# EAGLE schematic GasSensorModule_v2.1 (EAGLE 7.4.0)
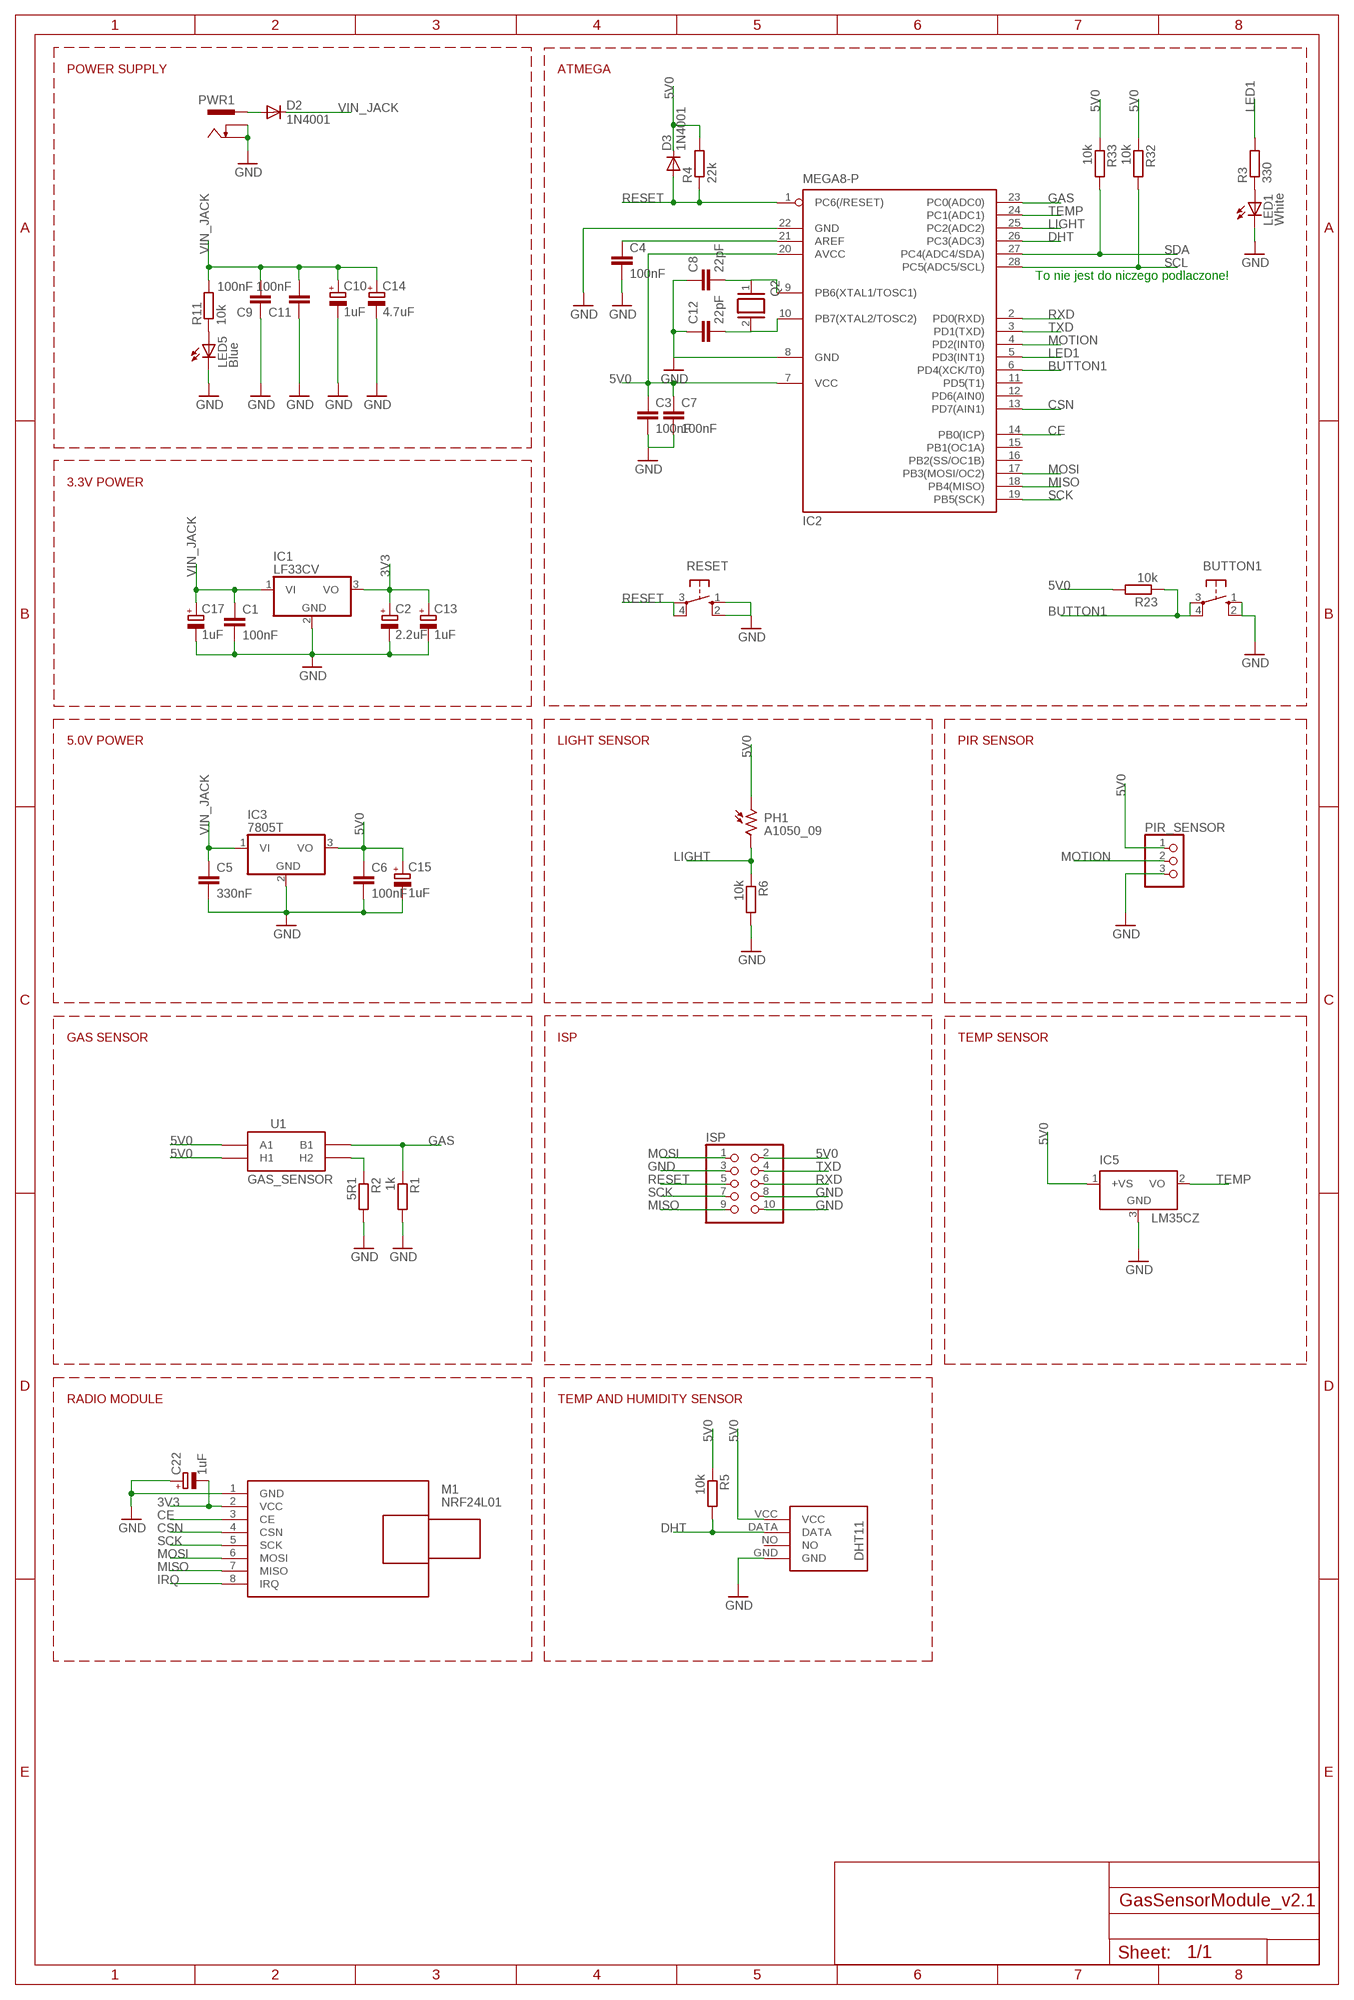
[diagram p0: schematic, sheet 1]

## Parts
BUTTON1  10-XX  [B3F-10XX]
C1  100nF  C-EU025-025X050  [C025-025X050]
C2  2.2uF  CPOL-EUE2.5-5  [E2,5-5]
C3  100nF  C-EU025-025X050  [C025-025X050]
C4  100nF  C-EU025-025X050  [C025-025X050]
C5  330nF  C-EU025-025X050  [C025-025X050]
C6  100nF  C-EU025-025X050  [C025-025X050]
C7  100nF  C-EU025-025X050  [C025-025X050]
C8  22pF  C-EU025-025X050  [C025-025X050]
C9  100nF  C-EU025-025X050  [C025-025X050]
C10  1uF  CPOL-EUE2.5-5  [E2,5-5]
C11  100nF  C-EU025-025X050  [C025-025X050]
C12  22pF  C-EU025-025X050  [C025-025X050]
C13  1uF  CPOL-EUE2.5-5  [E2,5-5]
C14  4.7uF  CPOL-EUE2.5-5  [E2,5-5]
C15  1uF  CPOL-EUE2.5-5  [E2,5-5]
C17  1uF  CPOL-EUE2.5-5  [E2,5-5]
C22  1uF  CPOL-EUE2.5-5  [E2,5-5]
D2  1N4001  1N4004  [DO41-10]
D3  1N4001  1N4004  [DO41-10]
IC1  LF33CV  7805T  [TO220H]
IC2  MEGA8-P  [DIL28-3]
IC3  7805T  [TO220H]
IC5  LM35CZ  [TO92]
ISP  PINHD-2X5  [2X05]
LED1  White  LED3MM  [LED3MM]
LED5  Blue  LED3MM  [LED3MM]
M1  NRF24L01  WIRELESS-NRF24L01-PA-EXT  [WIRELESS-NRD24L01-PA-EXT]
PH1  A1050_09  [T0-46-A10XX]
PIR_SENSOR  PINHD-1X3  [1X03]
PWR1  PWR-JAKPWR_JACK_UNI_MILLING  [PWR_JACK_UNI_MILLING]
Q2  XTAL/S  [QS]
R1  1k  R-EU_0207/10  [0207/10]
R2  5R1  R-EU_0207/10  [0207/10]
R3  330  R-EU_0207/10  [0207/10]
R4  22k  R-EU_0207/10  [0207/10]
R5  10k  R-EU_0207/10  [0207/10]
R6  10k  R-EU_0207/10  [0207/10]
R11  10k  R-EU_0207/10  [0207/10]
R23  10k  R-EU_0207/10  [0207/10]
R32  10k  R-EU_0207/10  [0207/10]
R33  10k  R-EU_0207/10  [0207/10]
RESET  10-XX  [B3F-10XX]
U1  GAS_SENSOR  [MQ-3]
U$1  DHT11-PION.  [DHT11-PION.]

## Nets
3V3: C2.+ C13.+ C22.- IC1.3(VO) M1.2(VCC)
5V0: C3.1 C6.1 C7.1 C15.+ D3.C IC2.7(VCC) IC2.20(AVCC) IC3.3(VO) IC5.1(+VS) ISP.2 PH1.1 PIR_SENSOR.1 R4.2 R5.1 R23.2 R32.1 R33.1 U1.A1 U1.HA(H1) U$1.VCC
BUTTON1: BUTTON1.3(P) BUTTON1.4(P1) IC2.6(PD4(XCK/T0)) R23.1
CE: IC2.14(PB0(ICP)) M1.3(CE)
CSN: IC2.13(PD7(AIN1)) M1.4(CSN)
DHT: IC2.26(PC3(ADC3)) R5.2 U$1.DATA
GAS: IC2.23(PC0(ADC0)) R1.1 U1.B1
GND: BUTTON1.1(S) BUTTON1.2(S1) C1.2 C2.- C3.2 C4.2 C5.2 C6.2 C7.2 C8.1 C9.1 C10.- C11.1 C12.1 C13.- C14.- C15.- C17.- C22.+ IC1.2(GND) IC2.8(GND) IC2.22(GND) IC3.2(GND) IC5.3(GND) ISP.3 ISP.8 ISP.10 LED1.K(C) LED5.K(C) M1.1(GND) PIR_SENSOR.3 PWR1.- PWR1.-- R1.2 R2.2 R6.2 RESET.1(S) RESET.2(S1) U$1.GND
IRQ: M1.8(IRQ)
LED1: IC2.5(PD3(INT1)) R3.2
LIGHT: IC2.25(PC2(ADC2)) PH1.2 R6.1
MISO: IC2.18(PB4(MISO)) ISP.9 M1.7(MISO)
MOSI: IC2.17(PB3(MOSI/OC2)) ISP.1 M1.6(MOSI)
MOTION: IC2.4(PD2(INT0)) PIR_SENSOR.2
N$1: C4.1 IC2.21(AREF)
N$3: R2.1 U1.HB(H2)
N$4: D2.A PWR1.+
N$5: LED1.A R3.1
N$10: LED5.A R11.1
N$29: C8.2 IC2.9(PB6(XTAL1/TOSC1)) Q2.1
N$35: C12.2 IC2.10(PB7(XTAL2/TOSC2)) Q2.2
RESET: D3.A IC2.1(PC6(/RESET)) ISP.5 R4.1 RESET.3(P) RESET.4(P1)
RXD: IC2.2(PD0(RXD)) ISP.6
SCK: IC2.19(PB5(SCK)) ISP.7 M1.5(SCK)
SCL: IC2.28(PC5(ADC5/SCL)) R32.2
SDA: IC2.27(PC4(ADC4/SDA)) R33.2
TEMP: IC2.24(PC1(ADC1)) IC5.2(VO)
TXD: IC2.3(PD1(TXD)) ISP.4
VIN_JACK: C1.1 C5.1 C9.2 C10.+ C11.2 C14.+ C17.+ D2.C IC1.1(VI) IC3.1(VI) R11.2
Unconnected: IC2.11(PD5(T1)) IC2.12(PD6(AIN0)) IC2.15(PB1(OC1A)) IC2.16(PB2(SS/OC1B)) U$1.NO

## Notes on the sheet
- POWER SUPPLY | ATMEGA
- To nie jest do niczego podlaczone!
- 3.3V POWER
- 5.0V POWER | LIGHT SENSOR | PIR SENSOR
- GAS SENSOR | ISP | TEMP SENSOR
- RADIO MODULE | TEMP AND HUMIDITY SENSOR

## Library data of the parts
BUTTON1 RESET = switch-omron:10-XX: OMRON SWITCH; MPN: B3F-1000; OC_FARNELL: 176432; OC_NEWARK: 36M3542
C1 C3-C9 C11 C12 = rcl:C-EU: CAPACITOR, European symbol
C2 C10 C13-C15 C17 C22 = rcl:CPOL-EU: POLARIZED CAPACITOR, European symbol
D2 D3 = diode:1N4004: DIODE general purpose rectifier, 1 A
IC1 IC3 = linear:78*: Positive VOLTAGE REGULATOR Source: http://cache.national.com/ds/LM/LM78L05.pdf http://www.fairchildsemi.com/ds/LM/LM7805.pdf
IC2 = atmel:MEGA8-P: MICROCONTROLLER 8 Kbytes FLASH, 1 kbytes SRAM, 512 bytes EEPROM, USART, 4-channel 10 bit ADC, 2-channel 8 bit ADC Pin compatible with Atmega48, ATMega88, ATMega168 Source: avr.lbr; OC_FARNELL: unknown; OC_NEWARK: unknown
IC5 = lm35:LM35: Single-Supply Centigrade Temperature Sensor Vout = (10mV/°C x Temp °C) +5mmmV Source: http://www.national.com/ds/LM/LM35.pdf
ISP = pinhead:PINHD-2X5: PIN HEADER
LED1 LED5 = led:LED: LED OSRAM: - CHIPLED LG R971, LG N971, LY N971, LG Q971, LY Q971, LO R971, LY R971 LH N974, LH R974 LS Q976, LO Q976, LY Q976 LO Q996 - Hyper CHIPLED LW Q18S LB Q993, LB Q99A, LB R99A - SideLED LS A670, LO A670, LY A670, LG A670, LP A670 LB A673, LV A673, LT A673, LW A673 LH A674 LY A675 LS A676, LA A676, LO A676, LY A676, LW A676 LS A679, LY A679, LG A679 - Hyper Micro SIDELED® LS Y876, LA Y876, LO Y876, LY Y876 LT Y87S - SmartLED LW L88C, LW L88S LB L89C, LB L89S, LG L890 LS L89K, LO L89K, LY L89K LS L896, LA L896, LO L896, LY L896 - TOPLED LS T670, LO T670, LY T670, LG T670, LP T670 LSG T670, LSP T670, LSY T670, LOP T670, LYG T670 LG T671, LOG T671, LSG T671 LB T673, LV T673, LT T673, LW T673 LH T674 LS T676, LA T676, LO T676, LY T676, LB T676, LH T676, LSB T676, LW T676 LB T67C, LV T67C, LT T67C, LS T67K, LO T67K, LY T67K, LW E67C LS E67B, LA E67B, LO E67B, LY E67B, LB E67C, LV E67C, LT E67C LW T67C LS T679, LY T679, LG T679 LS T770, LO T770, LY T770, LG T770, LP T770 LB T773, LV T773, LT T773, LW T773 LH T774 LS E675, LA E675, LY E675, LS T675 LS T776, LA T776, LO T776, LY T776, LB T776 LHGB T686 LT T68C, LB T68C - Hyper Mini TOPLED® LB M676 - Mini TOPLED Santana® LG M470 LS M47K, LO M47K, LY M47K Source: http://www.osram.convergy.de LUXEON: - LUMILED® LXK2-PW12-R00, LXK2-PW12-S00, LXK2-PW14-U00, LXK2-PW14-V00 LXK2-PM12-R00, LXK2-PM12-S00, LXK2-PM14-U00 LXK2-PE12-Q00, LXK2-PE12-R00, LXK2-PE12-S00, LXK2-PE14-T00, LXK2-PE14-U00 LXK2-PB12-K00, LXK2-PB12-L00, LXK2-PB12-M00, LXK2-PB14-N00, LXK2-PB14-P00, LXK2-PB14-Q00 LXK2-PR12-L00, LXK2-PR12-M00, LXK2-PR14-Q00, LXK2-PR14-R00 LXK2-PD12-Q00, LXK2-PD12-R00, LXK2-PD12-S00 LXK2-PH12-R00, LXK2-PH12-S00 LXK2-PL12-P00, LXK2-PL12-Q00, LXK2-PL12-R00 Source: www.luxeon.com KINGBRIGHT: KA-3528ASYC Source: www.kingbright.com
M1 = diy-modules:WIRELESS-NRF24L01-PA-EXT: 2.4 GHz Wireless Module based on NRF24L01 chip with preamplifier and external antenna
PH1 = photo-elements:A10: Sensor Robust Light Sensing Applications Outdoor Light Sensing Application Source: http://optoelectronics.perkinelmer.com/content/Datasheets/DTS_PhotocellsA1050.pdf
PIR_SENSOR = pinhead:PINHD-1X3: PIN HEADER
PWR1 = iMX233-OLINUXINO-MAXI_Rev_D:PWR-JAK
Q2 = special:XTAL/S: CRYSTAL
R1-R6 R11 R23 R32 R33 = rcl:R-EU_: RESISTOR, European symbol
U1 = SparkFun-Sensors:GAS_SENSOR: MQ-3 alcohol gas sensor . FP not tested. SEN-08880.
U$1 = DHT11:DHT11-PION.: DHT11 Czujnik temperatury i wilgotności (widok pionowy)